# EAGLE design Sender Board (EAGLE 7.7.0)
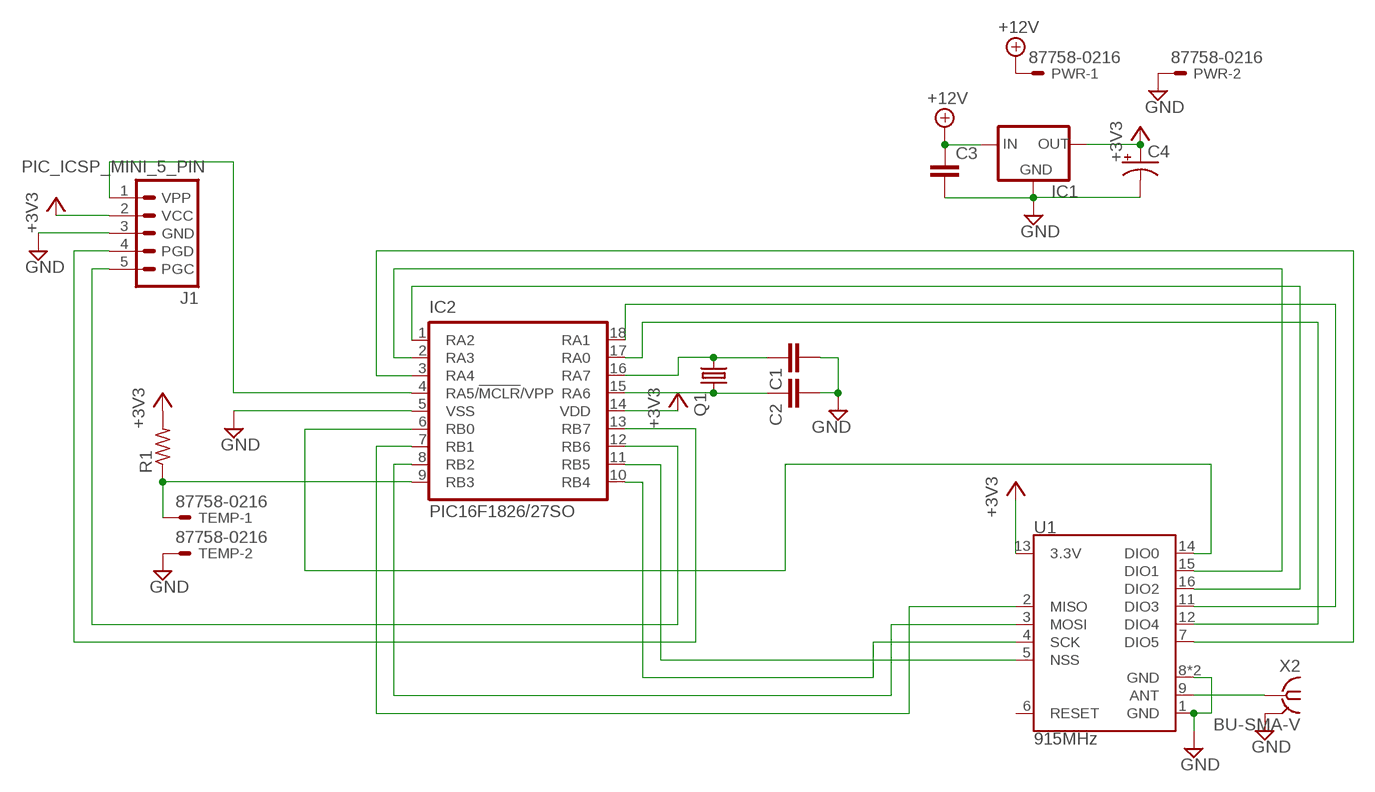
[diagram p0: schematic, sheet 1]

## Parts
C1  C-EUC1206  [C1206]
C2  C-EUC1206  [C1206]
C3  C-EU050-025X075  [C050-025X075]
C4  CPOL-USE3.5-8  [E3,5-8]
IC1  78LXX  [78LXX]
IC2  PIC16F1826/27SO  [SO-18W]
J1  PIC_ICSP_MINI_5_PIN  [PIC_ICSP_MINI_5_PIN]
PWR  87758-0216  [87758-0216]
Q1  CRYSTALTC26V  [TC26V]
R1  R-US_0204/7  [0204/7]
TEMP  87758-0216  [87758-0216]
U1  915MHz  RFM69HCW-915  [RFM69HCW-XXXS2]
X2  BU-SMA-V  [BU-SMA-V]

## Nets
+3V3: C4.+ IC1.OUT IC2.14(VDD) J1.2(VCC) R1.2 U1.13(3.3V)
+12V: C3.1 IC1.IN PWR.1
GND: C1.2 C2.2 C3.2 C4.- IC1.GND IC2.5(VSS) J1.3(GND) PWR.2 TEMP.2 U1.1(GND) U1.8(GND) U1.10(GND) X2.2 X2.3 X2.4 X2.5
MISO: IC2.7(RB1) U1.2(MISO)
MOSI: IC2.8(RB2) U1.3(MOSI)
N$1: IC2.13(RB7) J1.4(PGD)
N$2: IC2.12(RB6) J1.5(PGC)
N$3: IC2.4(RA5/!MCLR!/VPP) J1.1(VPP)
N$7: C1.1 IC2.16(RA7) Q1.1
N$8: C2.1 IC2.15(RA6) Q1.2
N$9: IC2.6(RB0) U1.14(DIO0)
N$10: U1.9(ANT) X2.1
N$11: IC2.9(RB3) R1.1 TEMP.1
N$12: IC2.11(RB5) U1.5(NSS)
N$13: IC2.18(RA1) U1.11(DIO3)
N$14: IC2.17(RA0) U1.12(DIO4)
N$15: IC2.1(RA2) U1.16(DIO2)
N$16: IC2.2(RA3) U1.15(DIO1)
N$17: IC2.3(RA4) U1.7(DIO5)
SCK: IC2.10(RB4) U1.4(SCK)
Unconnected: U1.6(RESET)

## Library data of the parts
C1-C3 = resistor:C-EU: CAPACITOR, European symbol
C4 = resistor:CPOL-US: POLARIZED CAPACITOR, American symbol
IC1 = v-reg:78LXX: VOLTAGE REGULATOR
IC2 = microchip:PIC16*F1826/27: 18/20/28-Pin Flash Microcontrollers with nanoWatt XLP Technology Source: www.microchip.com PIC16F1827.pdf
J1 = SparkFun-Connectors:PIC_ICSP_MINI_5_PIN: PIC-ICSP-Mini Miniature 5-pin connection for temporary programming of PICs. Use this device in your design to save space. Miniature ISCP Programming connector for PICs This 5 pin header contains all the lines necessary for programming most PIC microcontrollers. Use this device in your design to save space. Here is the connector we sell at SparkFun: 5-Pin Mini ICSP Connector <https://www.sparkfun.com/products/11264> (PRT-11264) It is used on these SparkFun products: USB Bit Whacker - 18F2553 Development Board <https://www.sparkfun.com/products/762> (DEV-00762) SparkFun Serial Enabled LCD Backpack <https://www.sparkfun.com/products/258> (LCD-00258) Also, if you need a nice PIC programmer, please check these out: MPLAB PICkit 3 <https://www.sparkfun.com/products/9973> (PGM-09973); PROD_ID: CONN-08314; SF_ID: PRT-11264
PWR TEMP = con-molex:87758-0216: 2 Pin - 2mm Dual Row Single Wafer, Vertical T/H HDR Source: http://www.molex.com/pdm_docs/sd/877580616_sd.pdf; MPN: 87758-0216; OC_FARNELL: unknown; OC_NEWARK: 94M1513
Q1 = crystal:CRYSTAL: CRYSTAL; OC_FARNELL: unknown; OC_NEWARK: unknown
R1 = resistor:R-US_: RESISTOR, American symbol
U1 = SparkFun-RF:RFM69H: Hope RF RFM69H ISM Transceiver Module The RFM69H is a transceiver module capable of operation over a wide frequency range, including the 315,433,868 and 915MHz license-free ISM (Industry Scientific and Medical) frequency bands. All major RF communication parameters are programmable and most of them can be dynamically set. The RFM69H offers the unique advantage of programmable narrow-band and wide- band communication modes. The RFM69H is optimized for low power consumption while offering high RF output power and channelized operation.Compliance ETSI and FCC regulations. Datasheet <http://www.hoperf.cn/upload/docs/RF/SX/RFM69H_DataSheet_v1.3.pdf> SparkFun Products RFM69HCW Wireless Transceiver - 915MHz <https://www.sparkfun.com/products/13909> (COM-13909) RFM69HCW Wireless Transceiver - 434MHz <https://www.sparkfun.com/products/13910> (COM-13910) SparkFun RFM69 Breakout (915MHz) <https://www.sparkfun.com/products/12775> (WRL-12775) SparkFun RFM69 Breakout (434MHz) <https://www.sparkfun.com/products/12823> (WRL-12823); PROD_ID: IC-11997
X2 = con-coax:BU-SMA-V: FEMALE SMA CONNECTOR Radiall distributor RS 112-3794; OC_FARNELL: unknown; OC_NEWARK: unknown

## Board
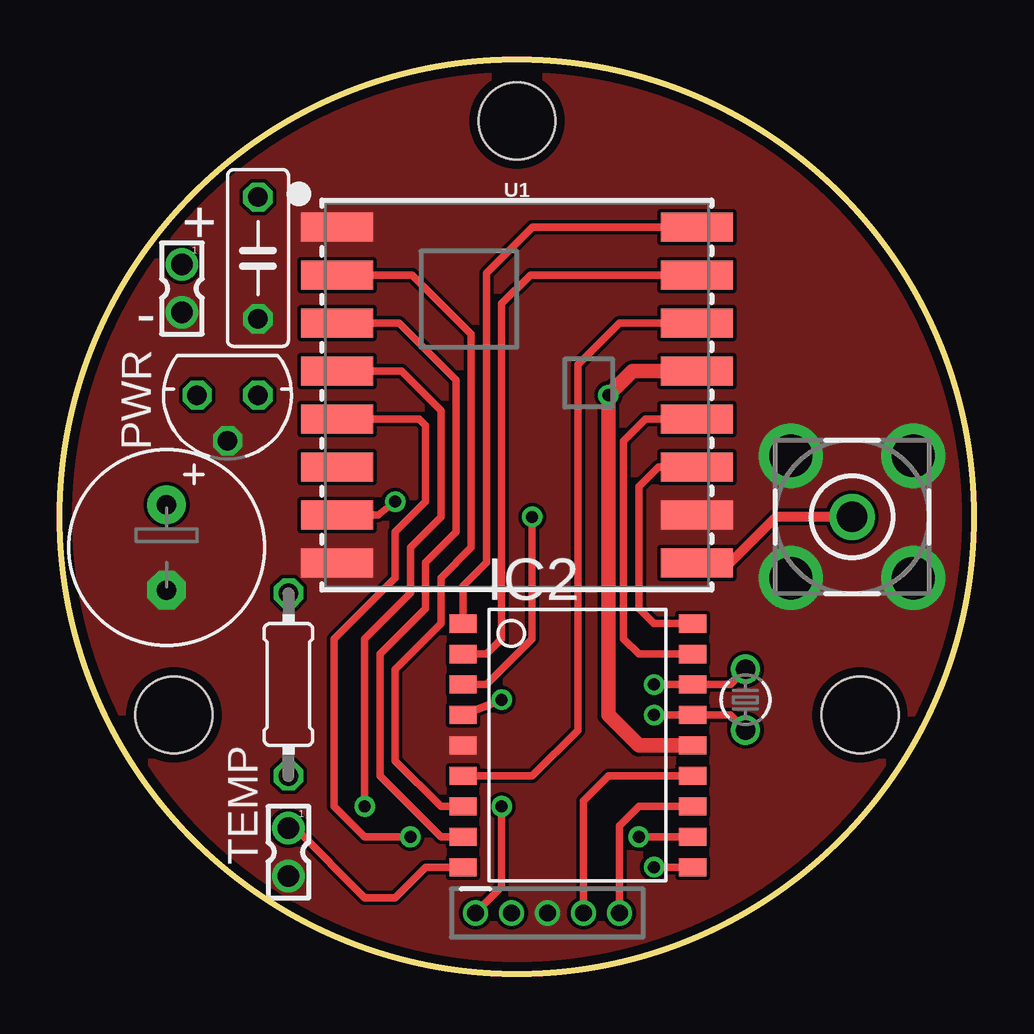
[diagram p1: board, top side]
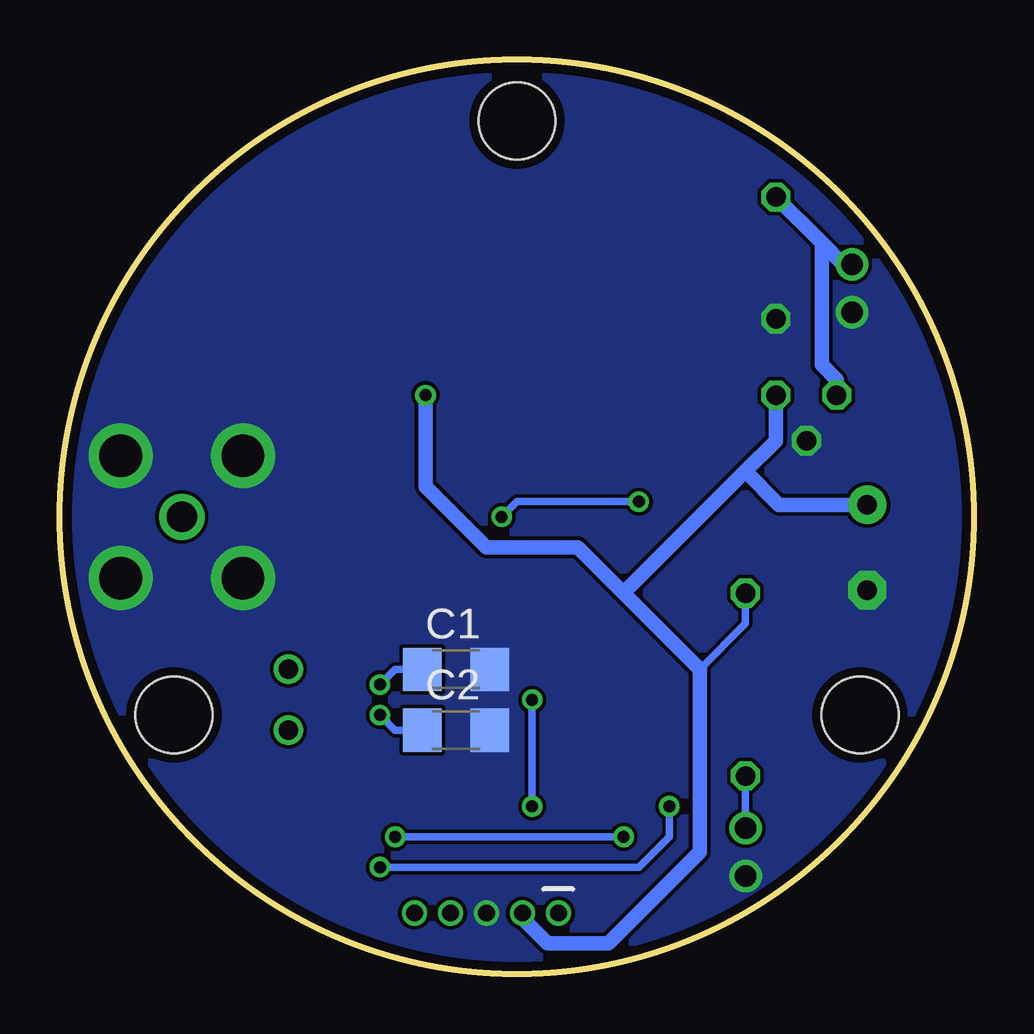
[diagram p2: board, bottom side, seen from below]

Size 38.1 x 38.1 mm. Coordinates in mm from the lower left corner, seen from the top.
Outline: circle at 19.05,19.05 radius 19.05
Copper layers (1*16): Top 0.0356mm / dielectric 1.5011mm / Bottom 0.0356mm
Design rules "Oshpark": minimum track width 6mil, minimum drill 13mil, track to track 6mil, track to pad 6mil, pad to pad 6mil, via to via 6mil, smd to smd 6mil, copper to edge 15mil, drill to drill 6mil, minimum pad ring 7mil, minimum via ring 7mil, stop-mask expansion 3mil, vias tented up to drill 0mil, thermal gap 10mil
Holes 3.2 mm at 19.05,35.56 4.75,10.79 33.35,10.79

### Footprints (pad centres in the part's own frame; a part is rotated, then mirrored left to right if it is on the bottom)
C1206 = smd 1.6 x 1.8: 1 -1.4,0; 2 1.4,0
C050-025X075 = drill 0.813 octagon: 1 -2.54,0; 2 2.54,0
E3,5-8 = drill 0.813 pad 1.6: + -1.778,0 | drill 0.813 pad 1.6 octagon: - 1.778,0
78LXX = drill 0.813 octagon: GND 0,1.905; IN 1.27,0; OUT -1.27,0
SO-18W = smd 0.762 x 1.143: 1 -5.08,-4.788; 2 -3.81,-4.788; 3 -2.54,-4.788; 4 -1.27,-4.788; 5 0,-4.788; 6 1.27,-4.788; 7 2.54,-4.788; 8 3.81,-4.788; 9 5.08,-4.788; 10 5.08,4.788; 11 3.81,4.788; 12 2.54,4.788; 13 1.27,4.788; 14 0,4.788; 15 -1.27,4.788; 16 -2.54,4.788; 17 -3.81,4.788; 18 -5.08,4.788
PIC_ICSP_MINI_5_PIN = drill 0.7: 1 -3,0; 2 -1.5,0; 3 0,0; 4 1.5,0; 5 3,0
87758-0216 = drill 0.9 pad 1.27: 1 0,-1; 2 0,1
TC26V = drill 0.813: 1 -1.27,0; 2 1.27,0
0204/7 = drill 0.813 octagon: 1 -3.81,0; 2 3.81,0
RFM69HCW-XXXS2 = smd 3 x 1.2: 1 -7.5,7; 2 -7.5,5; 3 -7.5,3; 4 -7.5,1; 5 -7.5,-1; 6 -7.5,-3; 7 -7.5,-5; 8 -7.5,-7; 9 7.5,-7; 10 7.5,-5; 11 7.5,-3; 12 7.5,-1; 13 7.5,1; 14 7.5,3; 15 7.5,5; 16 7.5,7
BU-SMA-V = drill 1.27: 1 0,0 | drill 1.778: 2 -2.55,2.55; 3 2.55,2.55; 4 2.55,-2.55; 5 -2.55,-2.55

### Placement (x,y rotation side)
C1  21.59,12.7 0 bottom
C2  21.59,10.16 0 bottom
C3  8.26,29.84 270 top
C4  4.45,17.78 270 top
IC1  6.99,24.13 180 top
IC2  21.59,9.53 270 top
J1  20.32,2.54 0 top
PWR  5.08,28.57 180 top
Q1  28.57,11.43 270 top
R1  9.53,12.06 90 top
TEMP  9.53,5.08 180 top
U1  19.05,24.13 0 top
X2  33.02,19.05 0 top

### Tracks (layer width: path | path; a pad name or v marks a point on that pad's centre or on a via)
+3V3  (via drill 0.5)
  Top 0.61: U1.13 23.86,25.13 v22.86,24.13 22.86,10.79 24.13,9.53 IC2.14
  Bottom 0.305: R1.2 9.53,14.61 11.43,12.7
  Bottom 0.61: 14.61,15.88 11.43,12.7 11.43,5.08 15.24,1.27 17.78,1.27 18.82,2.31 J1.2 | 14.61,15.88 16.51,17.78 20.32,17.78 22.86,20.32 v22.86,24.13 | IC1.OUT 8.26,22.23 9.53,20.95 | 9.53,20.95 14.61,15.88 | C4.+ 8.13,19.56 9.53,20.95
+12V
  Bottom 0.61: PWR.1 5.45,29.57 6.35,30.48 | 6.35,30.48 C3.1 | IC1.IN 5.71,24.77 6.35,25.4 6.35,30.48
GND
  pour Top (no thermals): -1.27,39.37 -1.27,0 41.91,0 41.91,39.37
  pour Bottom (no thermals): -3.81,41.91 -3.81,-3.81 44.45,-3.81 44.45,41.91
MISO
  Top 0.305: IC2.7 15.88,6.99 13.97,8.89 13.97,12.7 15.88,14.61 15.88,16.51 17.14,17.78 17.14,26.67 14.69,29.13 U1.2
MOSI
  Top 0.305: IC2.8 15.88,5.71 13.34,8.26 13.34,13.34 15.24,15.24 15.24,17.14 16.51,18.41 16.51,24.77 14.14,27.13 U1.3
N$1
  Top 0.305: J1.4 21.82,7.21 22.86,8.26 IC2.13
N$2
  Top 0.305: J1.5 23.32,6.17 24.13,6.99 IC2.12
N$3  (via drill 0.5)
  Top 0.305: IC2.4 v18.41,11.43 | v18.41,6.99 18.41,3.63 J1.1
  Bottom 0.305: v18.41,11.43 v18.41,6.99
N$7  (via drill 0.5)
  Top 0.305: Q1.1 27.94,12.06 IC2.16 v24.77,12.06
  Bottom 0.305: C1.1 24.13,12.7 v24.77,12.06
N$8  (via drill 0.5)
  Top 0.305: Q1.2 27.94,10.79 IC2.15 v24.77,10.79
  Bottom 0.305: C2.1 24.13,10.16 v24.77,10.79
N$9
  Top 0.305: U1.14 23.32,27.13 21.59,25.4 21.59,10.16 19.68,8.26 IC2.6
N$10
  Top 0.406: X2.1 29.84,19.05 27.94,17.14 26.57,17.14 U1.9
N$11
  Top 0.305: TEMP.1 9.79,6.08 12.7,3.17 13.97,3.17 15.24,4.45 IC2.9
  Bottom 0.305: TEMP.1 R1.1
N$12  (via drill 0.5)
  Top 0.305: U1.5 14.97,23.13 15.24,22.86 15.24,19.68 13.97,18.41 13.97,16.51 11.43,13.97 11.43,6.99 12.7,5.71 v14.61,5.71 | v24.13,5.71 IC2.11
  Bottom 0.305: v14.61,5.71 v24.13,5.71
N$13
  Top 0.305: IC2.18 24.77,14.61 24.13,15.24 24.13,20.32 24.94,21.13 U1.11
N$14
  Top 0.305: U1.12 24.4,23.13 23.5,22.23 23.5,13.97 24.13,13.34 IC2.17
N$15
  Top 0.305: U1.16 19.7,31.13 17.78,29.21 17.78,17.14 16.8,16.17 IC2.1
N$16
  Top 0.305: U1.15 19.61,29.13 18.41,27.94 18.41,13.97 17.78,13.34 IC2.2
N$17  (via drill 0.5)
  Top 0.305: IC2.3 17.78,12.06 19.68,13.97 v19.68,19.05 | U1.7 13.26,19.13 v13.97,19.68
  Bottom 0.305: v19.68,19.05 19.05,19.68 v13.97,19.68
SCK  (via drill 0.5)
  Top 0.305: IC2.10 v24.77,4.45 | v12.7,6.99 12.7,13.97 14.61,15.88 14.61,17.78 15.88,19.05 15.88,23.5 14.24,25.13 U1.4
  Bottom 0.305: v24.77,4.45 13.97,4.45 12.7,5.71 v12.7,6.99

### Text on the board
tNames: + | -